# EAGLE design CPU_Stop (EAGLE 7.5.0)
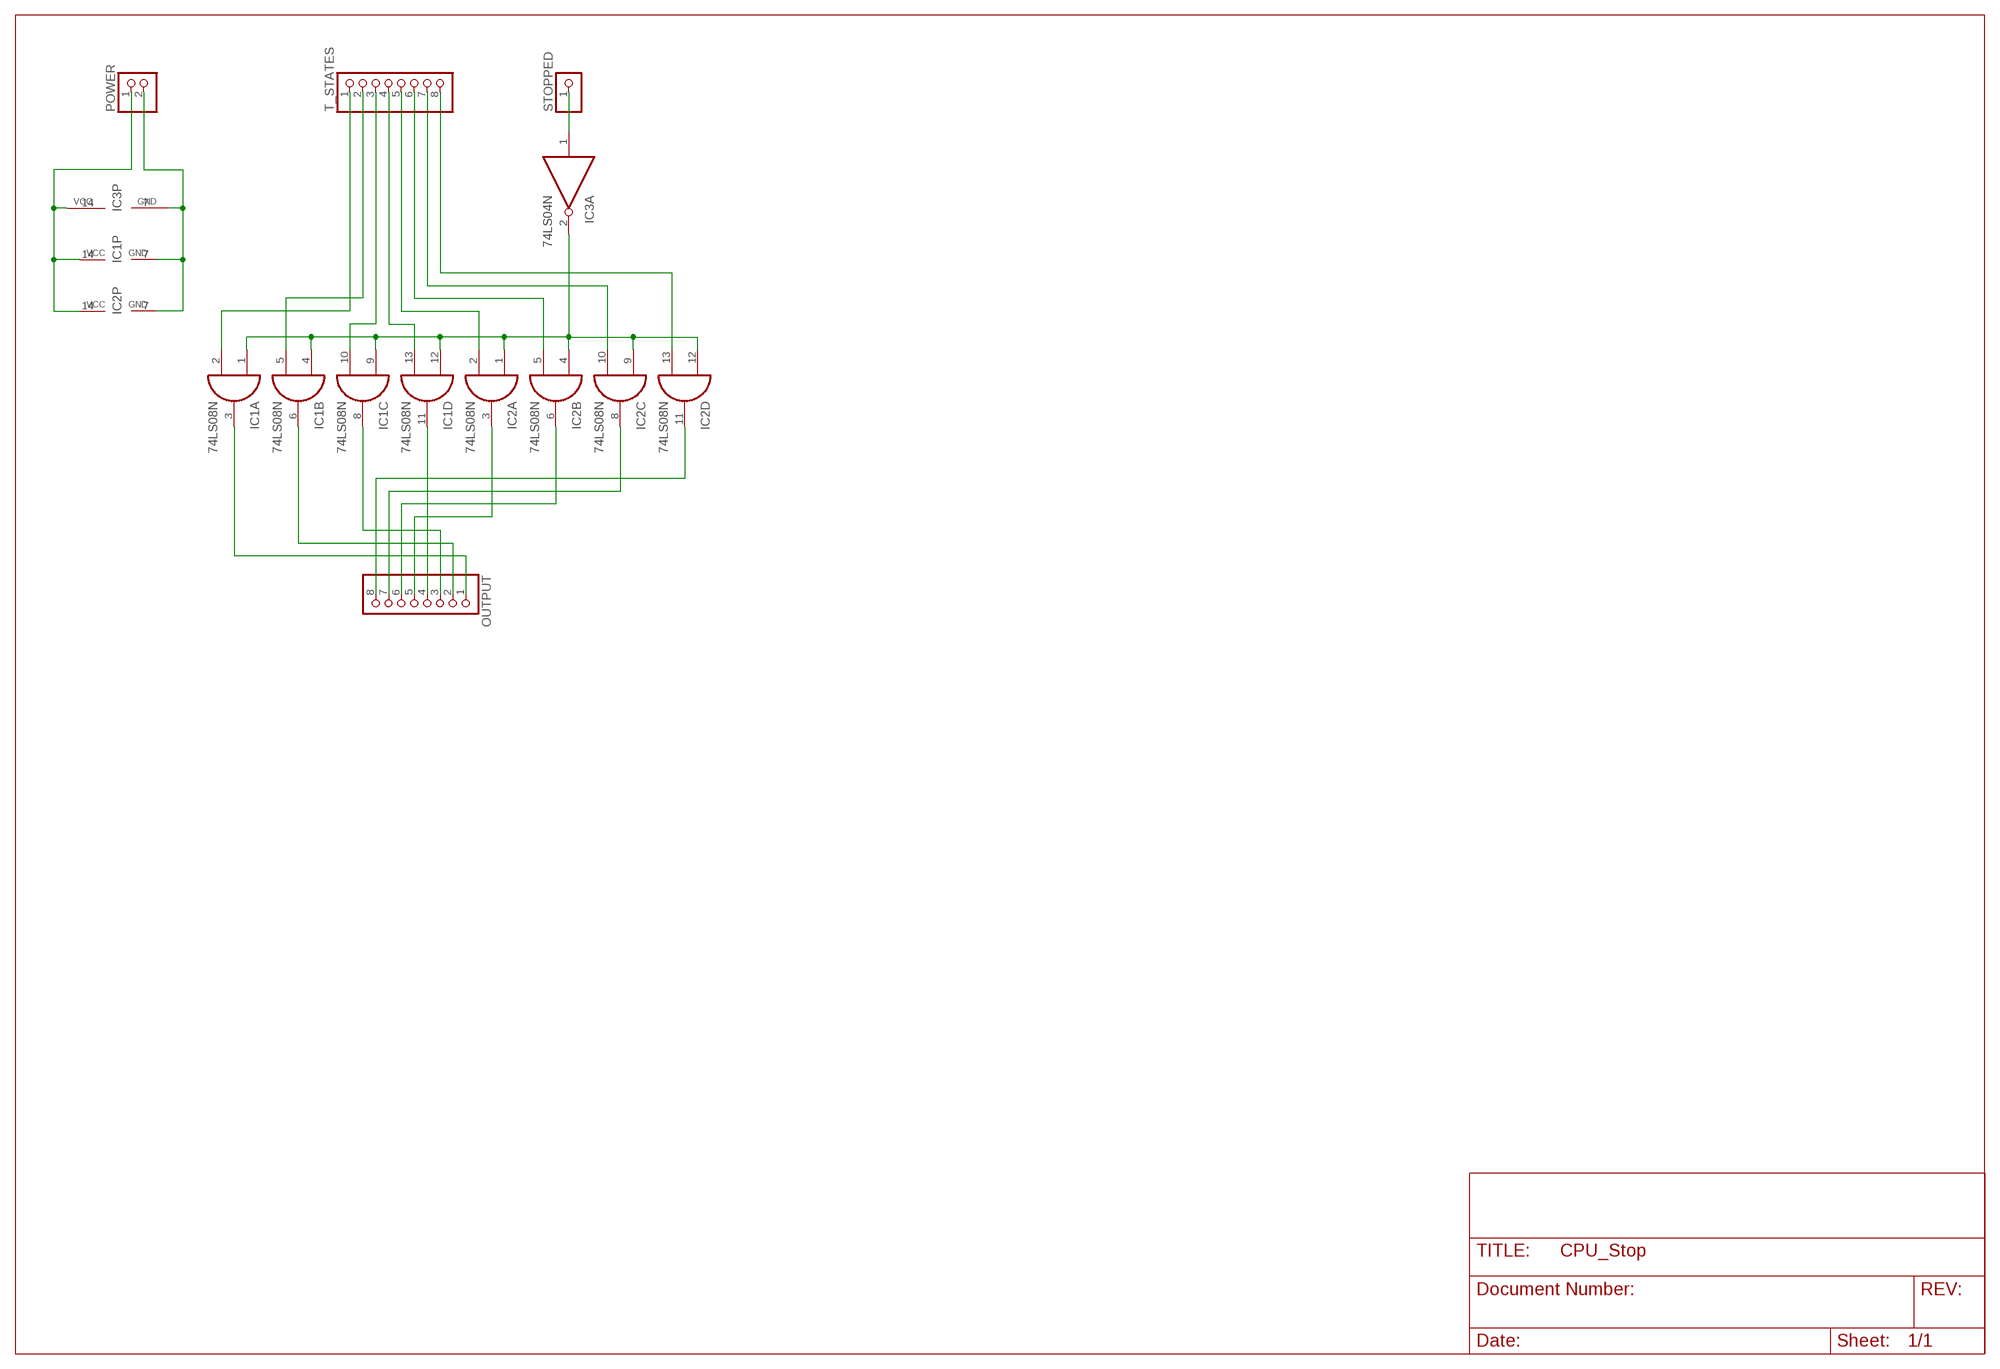
[diagram p0: schematic, sheet 1]

## Parts
IC1  74LS08N  [DIL14]
IC2  74LS08N  [DIL14]
IC3  74LS04N  [DIL14]
OUTPUT  PINHD-1X8  [1X08]
POWER  PINHD-1X2  [1X02]
STOPPED  PINHD-1X1  [1X01]
T_STATES  PINHD-1X8  [1X08]

## Nets
GND: IC1.7(P:GND) IC2.7(P:GND) IC3.7(P:GND) POWER.2
N$1: IC3.1(A:I) STOPPED.1
N$2: IC1.1(A:I0) IC1.4(B:I0) IC1.9(C:I0) IC1.12(D:I0) IC2.1(A:I0) IC2.4(B:I0) IC2.9(C:I0) IC2.12(D:I0) IC3.2(A:O)
N$3: IC1.2(A:I1) T_STATES.1
N$4: IC1.5(B:I1) T_STATES.2
N$5: IC1.10(C:I1) T_STATES.3
N$6: IC1.13(D:I1) T_STATES.4
N$7: IC2.2(A:I1) T_STATES.5
N$8: IC2.5(B:I1) T_STATES.6
N$9: IC2.10(C:I1) T_STATES.7
N$10: IC2.13(D:I1) T_STATES.8
N$11: IC1.3(A:O) OUTPUT.1
N$12: IC1.6(B:O) OUTPUT.2
N$13: IC1.8(C:O) OUTPUT.3
N$14: IC1.11(D:O) OUTPUT.4
N$15: IC2.3(A:O) OUTPUT.5
N$16: IC2.6(B:O) OUTPUT.6
N$17: IC2.8(C:O) OUTPUT.7
N$18: IC2.11(D:O) OUTPUT.8
VCC: IC1.14(P:VCC) IC2.14(P:VCC) IC3.14(P:VCC) POWER.1
Unconnected: IC3.3(B:I) IC3.4(B:O) IC3.5(C:I) IC3.6(C:O) IC3.8(D:O) IC3.9(D:I) IC3.10(E:O) IC3.11(E:I) IC3.12(F:O) IC3.13(F:I)

## Library data of the parts
IC1 IC2 = 74xx-eu:74*08: Quad 2-input AND gate
IC3 = 74xx-us:74*04: Hex INVERTER
OUTPUT T_STATES = pinhead:PINHD-1X8: PIN HEADER
POWER = pinhead:PINHD-1X2: PIN HEADER
STOPPED = pinhead:PINHD-1X1: PIN HEADER

## Board
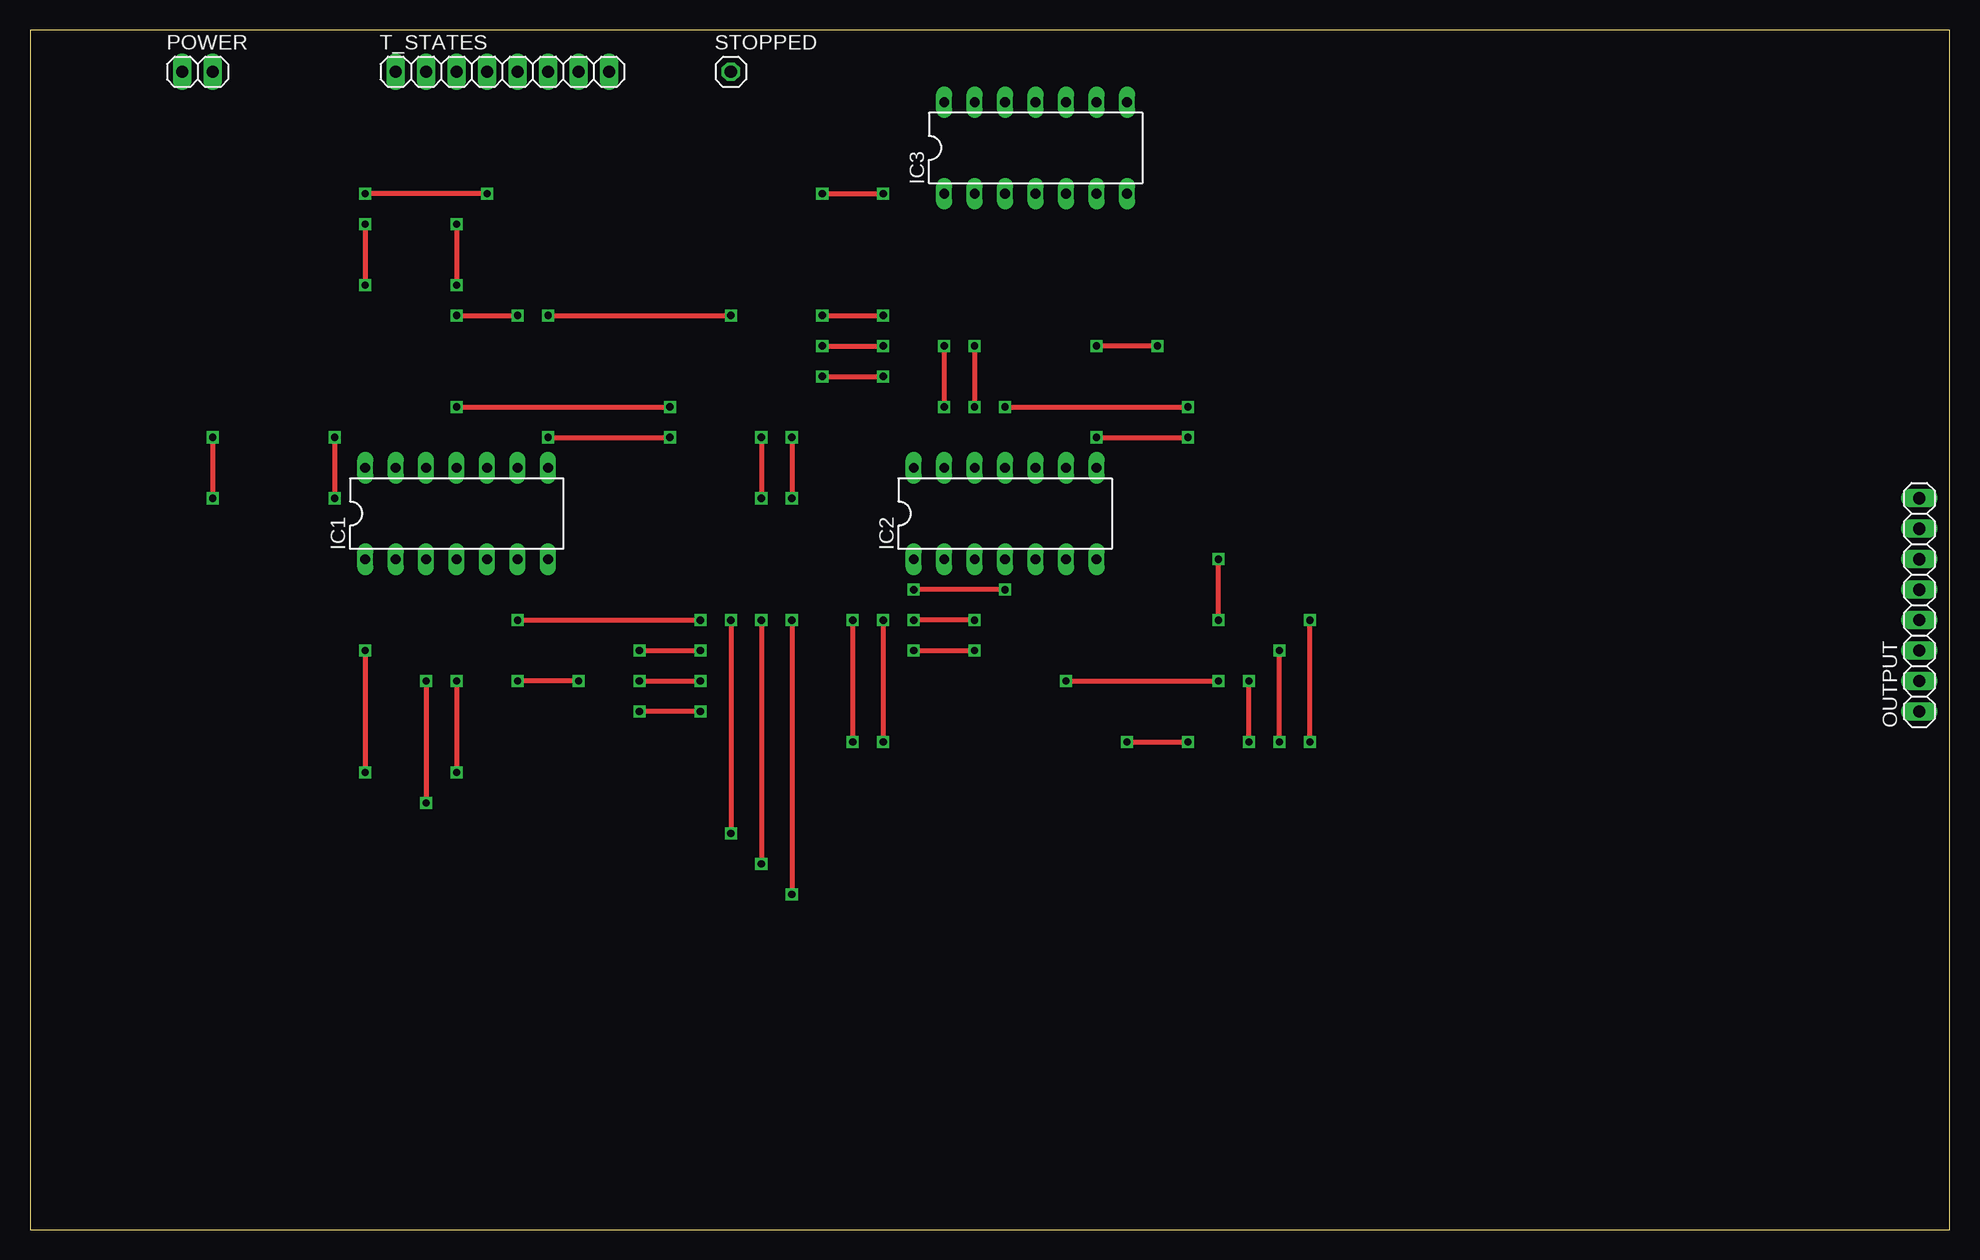
[diagram p1: board, top side]
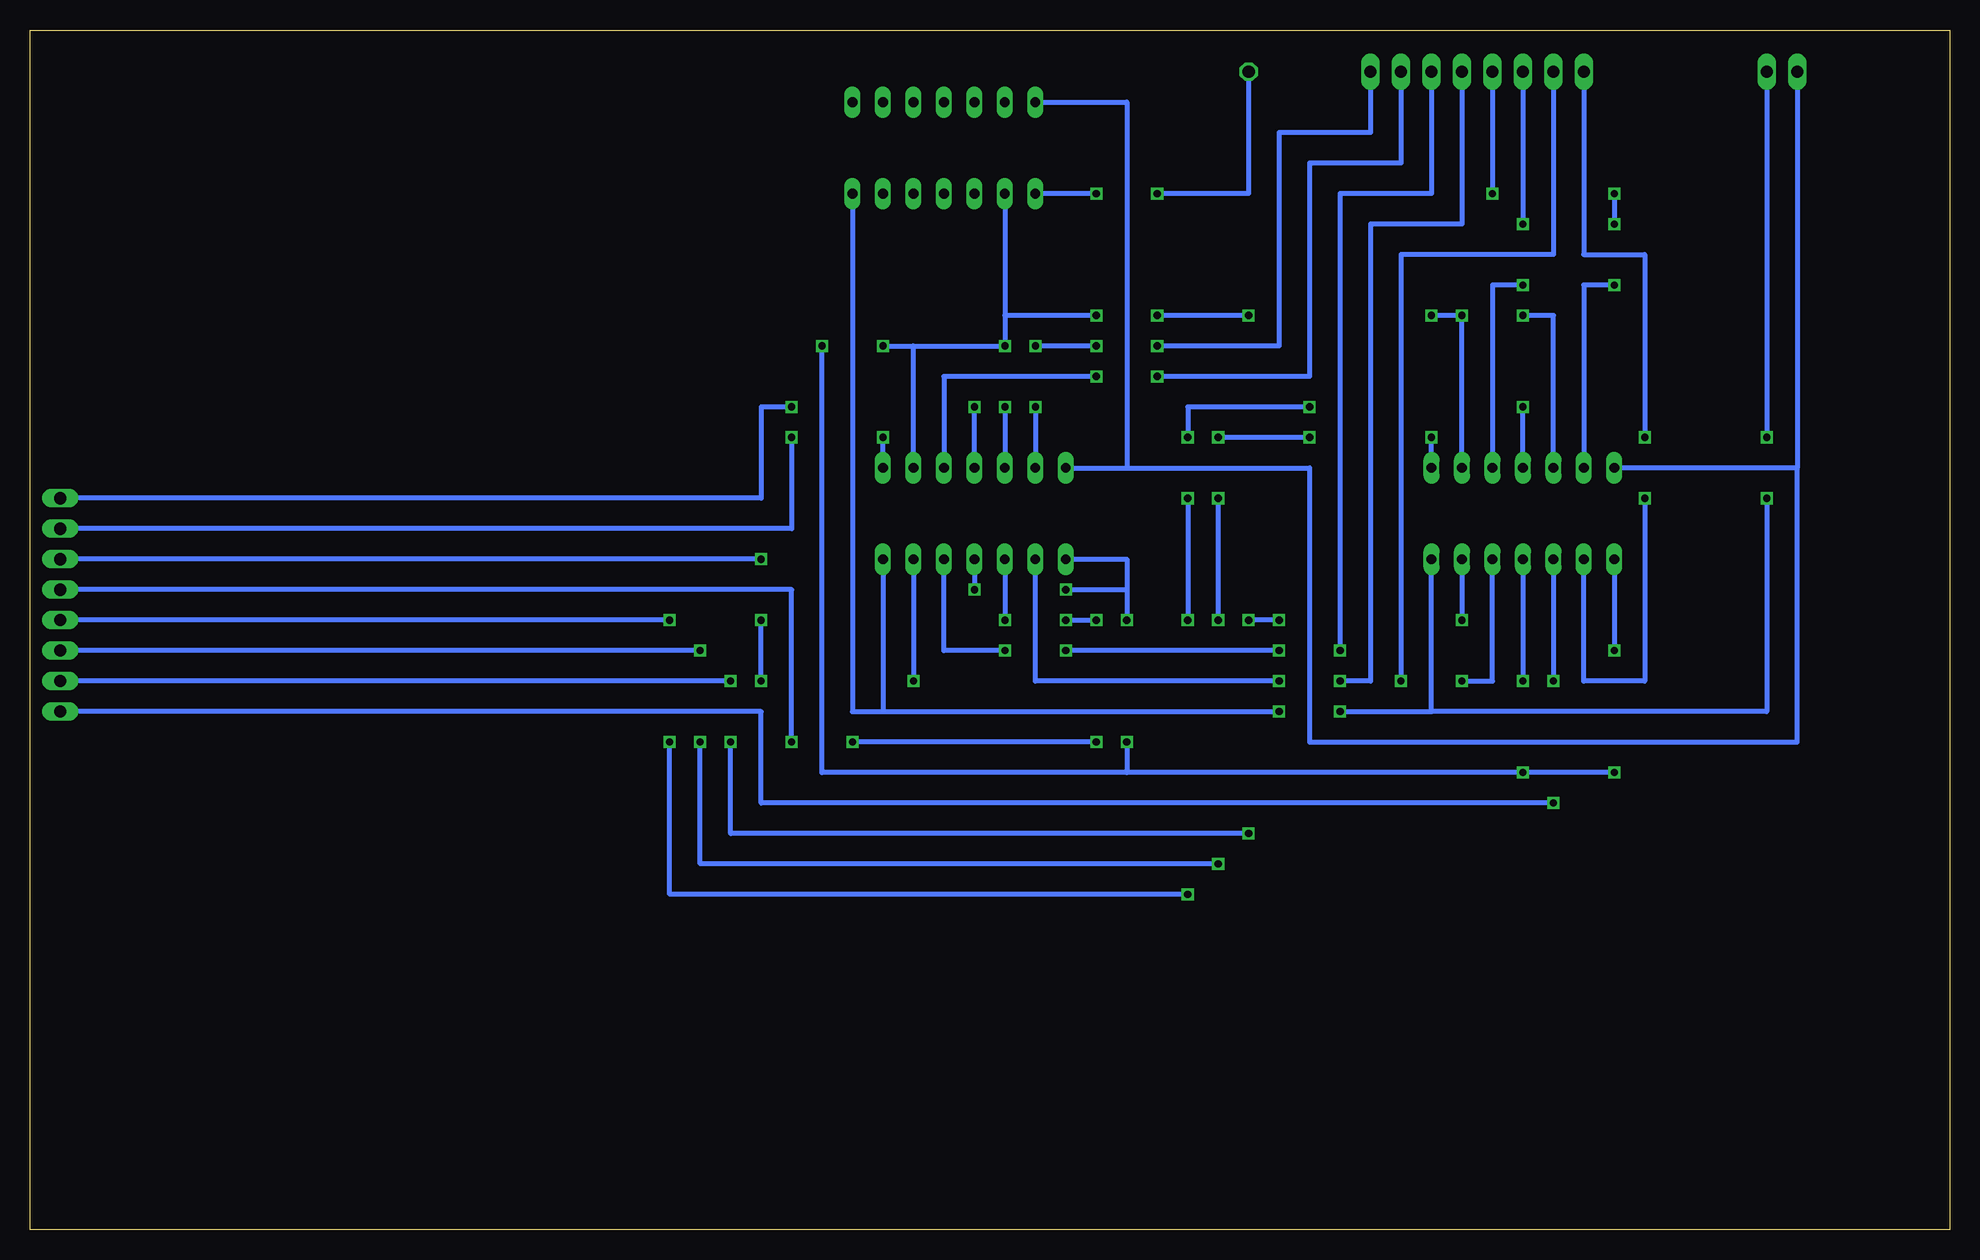
[diagram p2: board, bottom side, seen from below]

Size 160 x 100 mm. Coordinates in mm from the lower left corner, seen from the top.
Outline: 0,0 160,0 160,100 0,100 0,0
Copper layers (1*16): Top 0.035mm / dielectric 1.5mm / Bottom 0.035mm
Design rules "default": minimum track width 10mil, minimum drill 24mil, track to track 8mil, track to pad 8mil, pad to pad 8mil, via to via 8mil, smd to smd 8mil, copper to edge 40mil, drill to drill 8mil, minimum pad ring 10mil, minimum via ring 8mil, stop-mask expansion 4mil, vias tented up to drill 0mil, thermal gap 10mil

### Footprints (pad centres in the part's own frame; a part is rotated, then mirrored left to right if it is on the bottom)
DIL14 = drill 0.813 long: 1 -7.62,-3.81; 2 -5.08,-3.81; 3 -2.54,-3.81; 4 0,-3.81; 5 2.54,-3.81; 6 5.08,-3.81; 7 7.62,-3.81; 8 7.62,3.81; 9 5.08,3.81; 10 2.54,3.81; 11 0,3.81; 12 -2.54,3.81; 13 -5.08,3.81; 14 -7.62,3.81
1X08 = drill 1.016 long: 1 -8.89,0; 2 -6.35,0; 3 -3.81,0; 4 -1.27,0; 5 1.27,0; 6 3.81,0; 7 6.35,0; 8 8.89,0
1X02 = drill 1.016 long: 1 -1.27,0; 2 1.27,0
1X01 = drill 1.016 octagon: 1 0,0

### Placement (x,y rotation side)
IC1  35.56,59.69 0 top
IC2  81.28,59.69 0 top
IC3  83.82,90.17 0 top
OUTPUT  157.48,52.07 90 top
POWER  13.97,96.52 0 top
STOPPED  58.42,96.52 0 top
T_STATES  39.37,96.52 0 top

### Tracks (layer width: path | path; a pad name or v marks a point on that pad's centre or on a via)
GND  (via drill 0.6)
  Top 0.406: v15.24,66.04 v15.24,60.96 | v55.88,43.18 v50.8,43.18
  Bottom 0.406: POWER.2 v15.24,66.04 | v15.24,60.96 15.24,43.18 43.18,43.18 | 43.18,43.18 IC1.7 | IC2.7 88.9,43.18 | 88.9,43.18 v55.88,43.18 | v50.8,43.18 43.18,43.18 | IC3.7 91.44,43.18 88.9,43.18
N$1  (via drill 0.6)
  Top 0.406: v66.04,86.36 v71.12,86.36
  Bottom 0.406: STOPPED.1 58.42,86.36 v66.04,86.36 | v71.12,86.36 IC3.1
N$2  (via drill 0.6)
  Top 0.406: v78.74,73.66 v78.74,68.58 | v35.56,76.2 v40.64,76.2 | v43.18,76.2 v58.42,76.2 | v66.04,76.2 v71.12,76.2 | v27.94,48.26 v27.94,38.1 | v93.98,73.66 v88.9,73.66 | v35.56,45.72 v35.56,38.1 | v68.58,50.8 v68.58,40.64 | v81.28,53.34 v73.66,53.34
  Bottom 0.406: IC3.2 78.74,76.2 | 78.74,76.2 v78.74,73.66 86.36,73.66 | v78.74,68.58 IC2.12 | IC2.9 86.36,73.66 | IC1.12 33.02,76.2 v35.56,76.2 | v43.18,76.2 v40.64,76.2 IC1.9 | v58.42,76.2 v66.04,76.2 | v71.12,76.2 78.74,76.2 | IC1.1 v27.94,48.26 | v27.94,38.1 v35.56,38.1 68.58,38.1 | 68.58,38.1 93.98,38.1 v93.98,73.66 | v88.9,73.66 86.36,73.66 | IC1.4 v35.56,45.72 | IC2.1 68.58,55.88 68.58,53.34 | 68.58,53.34 v68.58,50.8 | v68.58,40.64 68.58,38.1 | IC2.4 v81.28,53.34 | v73.66,53.34 68.58,53.34
N$3  (via drill 0.6)
  Top 0.406: v25.4,66.04 v25.4,60.96
  Bottom 0.406: T_STATES.1 30.48,81.28 25.4,81.28 v25.4,66.04 | v25.4,60.96 25.4,45.72 30.48,45.72 IC1.2
N$4  (via drill 0.6)
  Top 0.406: v45.72,45.72 v40.64,45.72
  Bottom 0.406: T_STATES.2 33.02,81.28 45.72,81.28 v45.72,45.72 | v40.64,45.72 38.1,45.72 IC1.5
N$5  (via drill 0.6)
  Top 0.406: v35.56,83.82 v35.56,78.74
  Bottom 0.406: T_STATES.3 v35.56,83.82 | v35.56,78.74 38.1,78.74 IC1.10
N$6  (via drill 0.6)
  Top 0.406: v38.1,86.36 v27.94,86.36 | v27.94,83.82 v27.94,78.74
  Bottom 0.406: T_STATES.4 v38.1,86.36 | v27.94,86.36 v27.94,83.82 | v27.94,78.74 30.48,78.74 IC1.13
N$7  (via drill 0.6)
  Top 0.406: v50.8,45.72 v55.88,45.72
  Bottom 0.406: T_STATES.5 40.64,83.82 48.26,83.82 48.26,45.72 v50.8,45.72 | v55.88,45.72 76.2,45.72 IC2.2
N$8  (via drill 0.6)
  Top 0.406: v50.8,48.26 v55.88,48.26 | v73.66,48.26 v78.74,48.26
  Bottom 0.406: T_STATES.6 43.18,86.36 50.8,86.36 v50.8,48.26 | v55.88,48.26 v73.66,48.26 | v78.74,48.26 83.82,48.26 IC2.5
N$9  (via drill 0.6)
  Top 0.406: v66.04,71.12 v71.12,71.12
  Bottom 0.406: T_STATES.7 45.72,88.9 53.34,88.9 53.34,71.12 v66.04,71.12 | v71.12,71.12 83.82,71.12 IC2.10
N$10  (via drill 0.6)
  Top 0.406: v66.04,73.66 v71.12,73.66 | v76.2,73.66 v76.2,68.58
  Bottom 0.406: T_STATES.8 48.26,91.44 55.88,91.44 55.88,73.66 v66.04,73.66 | v71.12,73.66 v76.2,73.66 | v76.2,68.58 IC2.13
N$11  (via drill 0.6)
  Top 0.406: v33.02,45.72 v33.02,35.56
  Bottom 0.406: IC1.3 v33.02,45.72 | v33.02,35.56 99.06,35.56 99.06,43.18 OUTPUT.1
N$12  (via drill 0.6)
  Top 0.406: v40.64,50.8 v55.88,50.8 | v58.42,50.8 v58.42,33.02 | v101.6,40.64 v101.6,45.72
  Bottom 0.406: IC1.6 v40.64,50.8 | v55.88,50.8 v58.42,50.8 | v58.42,33.02 101.6,33.02 v101.6,40.64 | v101.6,45.72 OUTPUT.2
N$13  (via drill 0.6)
  Top 0.406: v43.18,66.04 v53.34,66.04 | v60.96,66.04 v60.96,60.96 | v60.96,50.8 v60.96,30.48 | v104.14,40.64 v104.14,48.26
  Bottom 0.406: IC1.8 v43.18,66.04 | v53.34,66.04 v60.96,66.04 | v60.96,60.96 v60.96,50.8 | v60.96,30.48 104.14,30.48 v104.14,40.64 | v104.14,48.26 OUTPUT.3
N$14  (via drill 0.6)
  Top 0.406: v35.56,68.58 v53.34,68.58 | v63.5,66.04 v63.5,60.96 | v63.5,50.8 v63.5,27.94 | v106.68,40.64 v106.68,50.8
  Bottom 0.406: IC1.11 v35.56,68.58 | v53.34,68.58 63.5,68.58 v63.5,66.04 | v63.5,60.96 v63.5,50.8 | v63.5,27.94 106.68,27.94 v106.68,40.64 | v106.68,50.8 OUTPUT.4
N$15  (via drill 0.6)
  Top 0.406: v78.74,50.8 v73.66,50.8 | v71.12,50.8 v71.12,40.64 | v91.44,40.64 v96.52,40.64
  Bottom 0.406: IC2.3 v78.74,50.8 | v73.66,50.8 v71.12,50.8 | v71.12,40.64 v91.44,40.64 | v96.52,40.64 96.52,53.34 OUTPUT.5
N$16  (via drill 0.6)
  Top 0.406: v86.36,45.72 v99.06,45.72 | v99.06,50.8 v99.06,55.88
  Bottom 0.406: IC2.6 v86.36,45.72 | v99.06,45.72 v99.06,50.8 | v99.06,55.88 OUTPUT.6
N$17  (via drill 0.6)
  Top 0.406: v88.9,66.04 v96.52,66.04
  Bottom 0.406: IC2.8 v88.9,66.04 | v96.52,66.04 96.52,58.42 OUTPUT.7
N$18  (via drill 0.6)
  Top 0.406: v81.28,68.58 v96.52,68.58
  Bottom 0.406: IC2.11 v81.28,68.58 | v96.52,68.58 99.06,68.58 99.06,60.96 OUTPUT.8
VCC
  Bottom 0.406: POWER.1 12.7,63.5 | 12.7,63.5 IC1.14 | IC2.14 68.58,63.5 | 68.58,63.5 53.34,63.5 53.34,40.64 12.7,40.64 12.7,63.5 | IC3.14 68.58,93.98 68.58,63.5